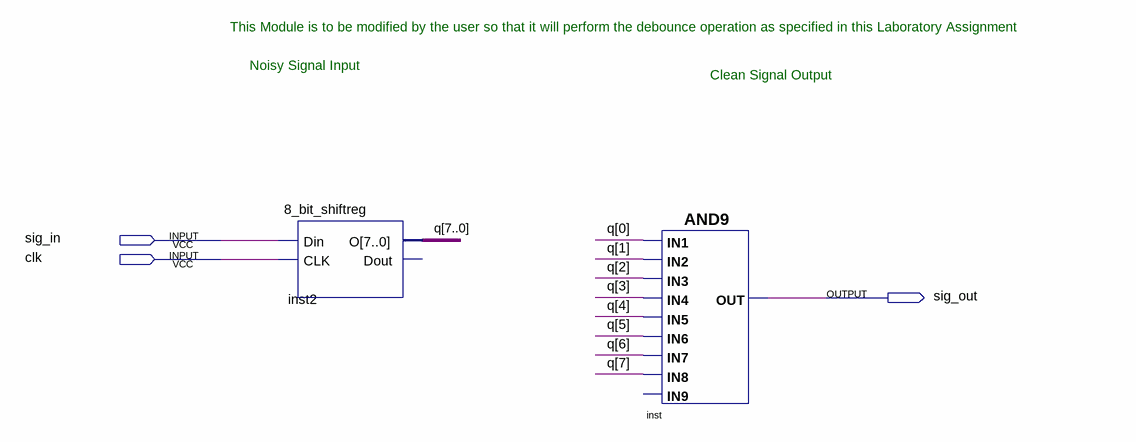
[diagram p0: schematic sheet]
// Quartus schematic debounce.bdf as structural Verilog: 2 symbols, 3 pins
module debounce (
  input  sig_in,
  input  clk,
  output sig_out
);

  wire [7:0] q;

  \8_bit_shiftreg  inst2 (.Din(sig_in), .CLK(clk), .O(q));  // open: Dout
  and inst (sig_out, q[0], q[1], q[2], q[3], q[4], q[5], q[6], q[7]);  // open: IN9

  // Notes on the sheet:
  //   This Module is to be modified by the user so that it will perform the debounce operation as specified in this Laboratory Assignment
  //   Noisy Signal Input
  //   Clean Signal Output
endmodule
